# Altium schematic sheet Mechanicals.SchDoc: Iris
size A3; Organization: Toradex AG; Address1: Altsagenstrasse 5; Address2: Horw; Address3: 6048; Address4: Switzerland; DocumentNumber: 16; Revision: V2.0; SheetNumber: 16; SheetTotal: 16
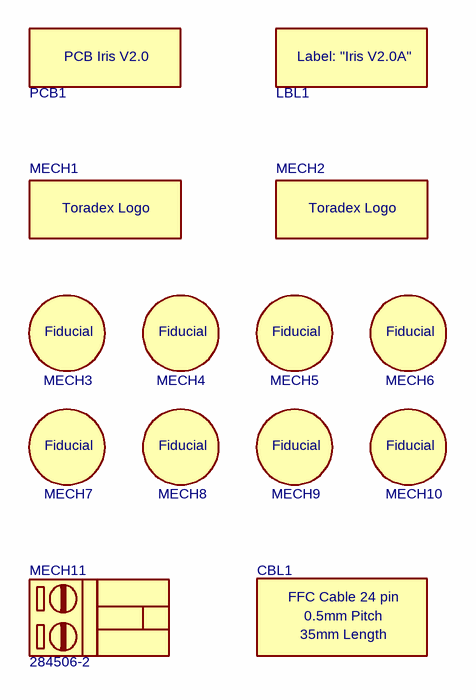
[diagram p0: Mechanicals.SchDoc]

## Parts
CBL1  FFC Cable  (value not drawn)
LBL1  Barcode Label  [T_BARCODE_LABEL]  (value not drawn)
MECH1  Toradex_Logo  [T_TORADEX_LOGO]  (value not drawn)
MECH2  Toradex_Logo  [T_TORADEX_LOGO]  (value not drawn)
MECH3  MECH-Fiducial  [T_Fiducial]  (value not drawn)
MECH4  MECH-Fiducial  [T_Fiducial]  (value not drawn)
MECH5  MECH-Fiducial  [T_Fiducial]  (value not drawn)
MECH6  MECH-Fiducial  [T_Fiducial]  (value not drawn)
MECH7  MECH-Fiducial  [T_Fiducial]  (value not drawn)
MECH8  MECH-Fiducial  [T_Fiducial]  (value not drawn)
MECH9  MECH-Fiducial  [T_Fiducial]  (value not drawn)
MECH10  MECH-Fiducial  [T_Fiducial]  (value not drawn)
MECH11  284506-2
PCB1  MECH-Iris  (value not drawn)

## Notes on the sheet
- Title
- Size:
- Date:
- A3
- Number:
- Time:
- Revision:
- Sheet
- of
- File:
- (in symbol MECH-FFC-Cable-top/top-24-35mm-0.5mm) FFC Cable 24 pin; 0.5mm Pitch; 35mm Length
- (in symbol PCB-Iris) PCB Iris V2.0
- (in symbol Toradex_Logo) Toradex Logo

## Library data of the parts
CBL1 = MECH-FFC-Cable-top/top-24-35mm-0.5mm: FFC Cable 24 pin 35mm 0.5mm pitch; Manufacturer Name: Generic; Manufacturer Part No.: *
LBL1 = Label: "Iris V2.0A": Manufacturer Name: Generic; Manufacturer Part No.: Barcode Label
MECH3-MECH10 = MECH-Fiducial: Fiducial
MECH11 = CON-Tyco-284506-2-1x2-Mate: Terminal Block Power Connector Mate; Manufacturer Name: Tyco; No. of ways: 1x2; Pitch: 3.5mm; Manufacturer Part No.: 284506-2
PCB1 = PCB-Iris: PCB Iris; Manufacturer Name: Generic; Manufacturer Part No.: *